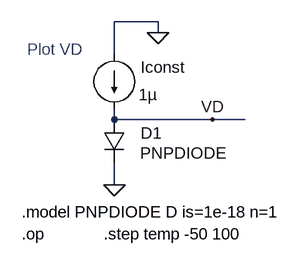
[diagram p0: schematic ID_V1.asc]
ID_V1.asc, the LTspice schematic file:
Version 4
SHEET 1 2876 680
WIRE 1744 -624 1680 -624
WIRE 1744 -608 1744 -624
WIRE 1680 -576 1680 -624
WIRE 1680 -480 1680 -496
WIRE 1824 -480 1680 -480
WIRE 1872 -480 1824 -480
WIRE 1680 -384 1680 -416
FLAG 1744 -608 0
FLAG 1680 -384 0
FLAG 1824 -480 VD
SYMBOL diode 1664 -480 R0
WINDOW 0 55 20 Left 2
WINDOW 3 54 49 Left 2
SYMATTR InstName D1
SYMATTR Value PNPDIODE
SYMBOL current 1680 -576 R0
WINDOW 0 39 19 Left 2
WINDOW 3 36 59 Left 2
SYMATTR InstName Iconst
SYMATTR Value 1µ
TEXT 1552 -584 Left 2 ;Plot VD
TEXT 1544 -344 Left 2 !.model PNPDIODE D is=1e-18 n=1
TEXT 1544 -312 Left 2 !.op
TEXT 1664 -312 Left 2 !.step temp -50 100

The netlist it stands for:
* ID_V1.asc
D1 VD 0 PNPDIODE
Iconst 0 VD 1µ
.model D D
.lib standard.dio
* Plot VD
.model PNPDIODE D is=1e-18 n=1
.op
.step temp -50 100
.backanno
.end